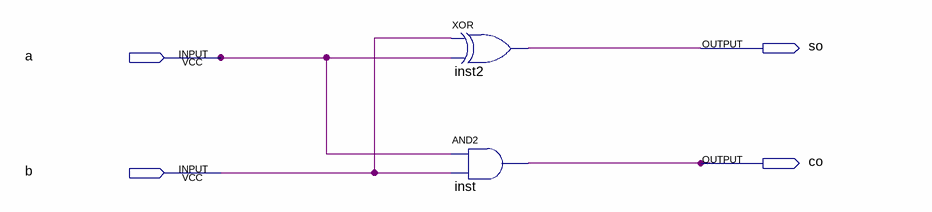
[diagram p0: schematic sheet]
// Quartus schematic half_ad.bdf as structural Verilog: 2 symbols, 4 pins
module half_ad (
  input  a,
  input  b,
  output so,
  output co
);

  xor inst2 (so, b, a);
  and inst (co, a, b);
endmodule
